# Altium schematic sheet TH1.SchDoc
size Letter; SheetNumber: 2; SheetTotal: 6
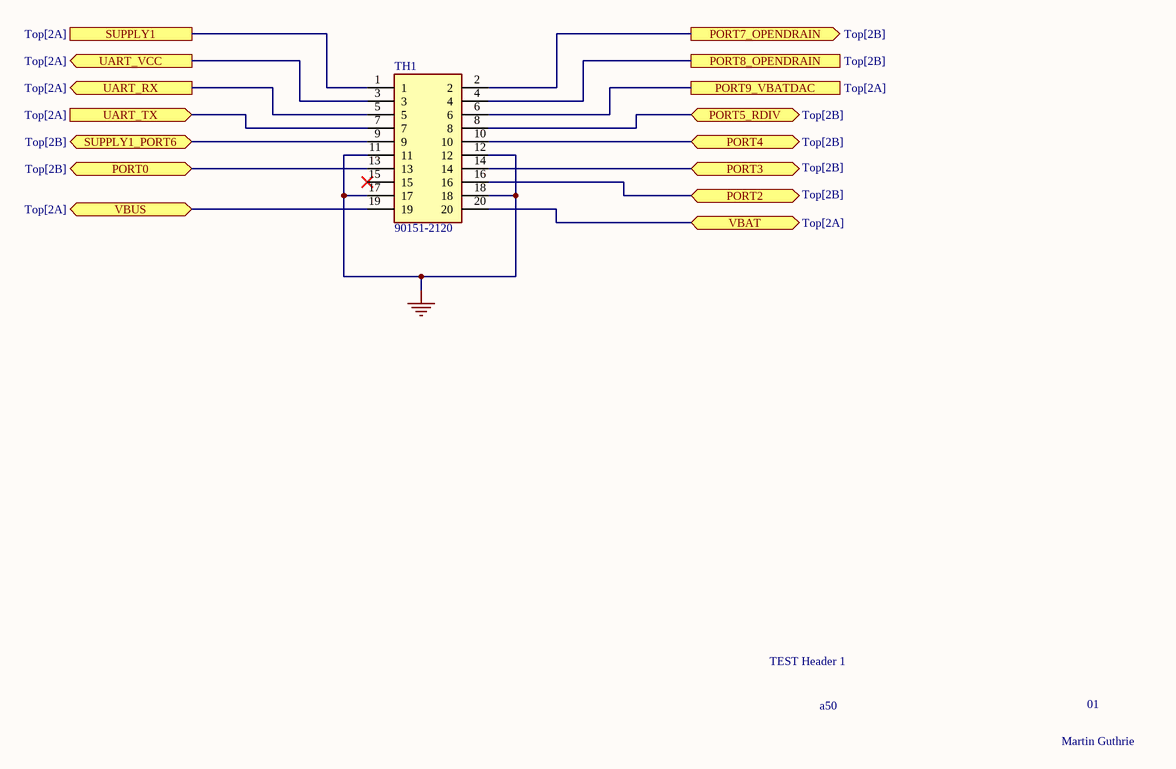
[diagram p0: TH1.SchDoc]

## Parts
TH1  90151-2120  [90151-2120]

## Ports
PORT0 (bidir, see Top[2B]), PORT2 (bidir, see Top[2B]), PORT3 (bidir, see Top[2B]), PORT4 (bidir, see Top[2B]), PORT5_RDIV (bidir, see Top[2B]), PORT7_OPENDRAIN (out, see Top[2B]), PORT8_OPENDRAIN (see Top[2B]), PORT9_VBATDAC (see Top[2A]), SUPPLY1 (see Top[2A]), SUPPLY1_PORT6 (bidir, see Top[2B]), UART_RX (out, see Top[2A]), UART_TX (in, see Top[2A]), UART_VCC (out, see Top[2A]), VBAT (bidir, see Top[2A]), VBUS (bidir, see Top[2A])

## Nets
GND: TH1.11 TH1.12 TH1.17 TH1.18
PORT0: TH1.13 ; port PORT0
PORT2: TH1.16 ; port PORT2
PORT3: TH1.14 ; port PORT3
PORT4: TH1.10 ; port PORT4
PORT5_RDIV: TH1.8 ; port PORT5_RDIV
PORT7_OPENDRAIN: TH1.2 ; port PORT7_OPENDRAIN
PORT8_OPENDRAIN: TH1.4 ; port PORT8_OPENDRAIN
PORT9_VBATDAC: TH1.6 ; port PORT9_VBATDAC
SUPPLY1: TH1.1 ; port SUPPLY1
SUPPLY1_PORT6: TH1.9 ; port SUPPLY1_PORT6
UART_RX: TH1.5 ; port UART_RX
UART_TX: TH1.7 ; port UART_TX
UART_VCC: TH1.3 ; port UART_VCC
VBAT: TH1.20 ; port VBAT
VBUS: TH1.19 ; port VBUS

Not connected (* = marked no-connect by the designer): TH1 15*

## Notes on the sheet
- TEST Header 1
- a50
- 01
- Martin Guthrie

## Library data of the parts
TH1 = 90151-2120: Connector; Manufacturer_Name: Molex; Datasheet Link: https://www.molex.com/pdm_docs/sd/901512120_sd.pdf; Height: 8.7mm; Manufacturer_Part_Number: 90151-2120; Mouser Part Number: 538-90151-2120; Mouser Price/Stock: https://www.mouser.co.uk/ProductDetail/Molex/90151-2120?qs=XmV31zLAuMHqFInYdcmaXg%3D%3D